# Altium project LAMP Chip PCB.PrjPCB
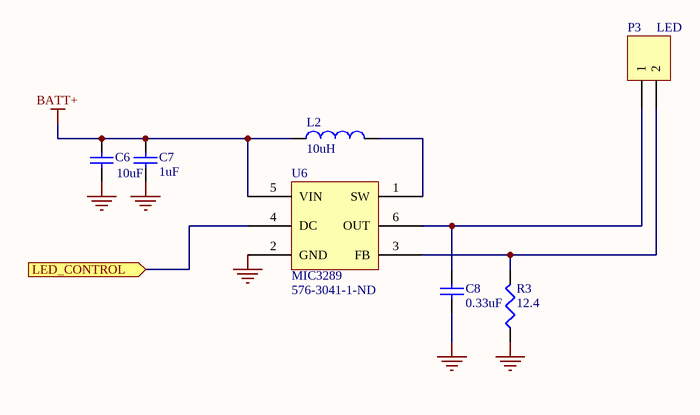
[diagram p0: LED Driver.SchDoc]
3 sheets, 133 parts. Net scope: flat (ports and power ports of the same name join across sheets).
Board file: Chip Reader PCB.PcbDoc
Sheets:
  LED Driver.SchDoc
  Heater Driver.SchDoc
  Photodiodes.SchDoc

## Sheet LED Driver.SchDoc: MicroBAR - LED Driver Circuit
size A; DrawnBy: Frankie Myers; Engineer: Frankie Myers; Organization: UC Berkeley

### Parts
C6  value 10uF  [CAPC3216L]  (hidden comment: Cap)
C7  value 1uF  [CAPC3216L]  (hidden comment: Cap Semi)
C8  value 0.33uF  [CAPC3216L]  (hidden comment: Cap Semi)
L2  value 10uH  [MURATA SMT INDUCTOR]  (hidden comment: Inductor)
P3  LED  [2MM JST PH - 2 PIN]
R3  value 12.4  [RESC3216L]  (hidden comment: Res3)
U6  MIC3289  Supplier Part Number 1: 576-3041-1-ND  [SOT-23_A]

### Ports
LED_CONTROL

### Nets
BATT+: C6.2 C7.2 L2.1 U6.5(VIN)
GND: C6.1 C7.1 C8.1 R3.1 U6.2(GND)
NetC8_2: C8.2 P3.1 U6.6(OUT)
NetL2_2: L2.2 U6.1(SW)
NetP1_13: U6.4(DC) ; port LED_CONTROL
NetP3_2: P3.2 R3.2 U6.3(FB)

### Library data of the parts
C6 = Cap: Capacitor; Published: 8-Jun-2000; LatestRevisionDate: 17-Jul-2002; LatestRevisionNote: Re-released for DXP Platform.; PackageReference: RAD-0.3; Publisher: Altium Limited
C7 C8 = Cap Semi: Capacitor (Semiconductor SIM Model); Published: 8-Jun-2000; LatestRevisionDate: 29-May-2009; LatestRevisionNote: IPC-7351 Footprint Added.; PackageReference: C1206; Publisher: Altium Limited; PackageDescription: Chip Capacitor
L2 = Inductor: Code_IEC: 1005; Published: 8-Jun-2000; LatestRevisionDate: 29-May-2009; LatestRevisionNote: IPC-7351 Footprint Added.; PackageReference: 0402-A; Publisher: Altium Limited; PackageDescription: Chip Inductor; Code_JEITA: 0402
P3 = Header 2: Header, 2-Pin; LatestRevisionDate: 17-Jul-2002; LatestRevisionNote: Re-released for DXP Platform.; Publisher: Altium Limited
R3 = Res3: Resistor; Published: 8-Jun-2000; LatestRevisionDate: 29-May-2009; LatestRevisionNote: IPC-7351 Footprint Added.; PackageReference: J1-0603; Publisher: Altium Limited; PackageDescription: Chip Resistor
U6 = MIC3289: Supplier 1: Digi-Key

## Sheet Heater Driver.SchDoc: MicroBAR - Step-Up DC-DC Converter for ITO Heater
size A; DrawnBy: Frankie Myers; Engineer: Frankie Myers; Organization: UC Berkeley
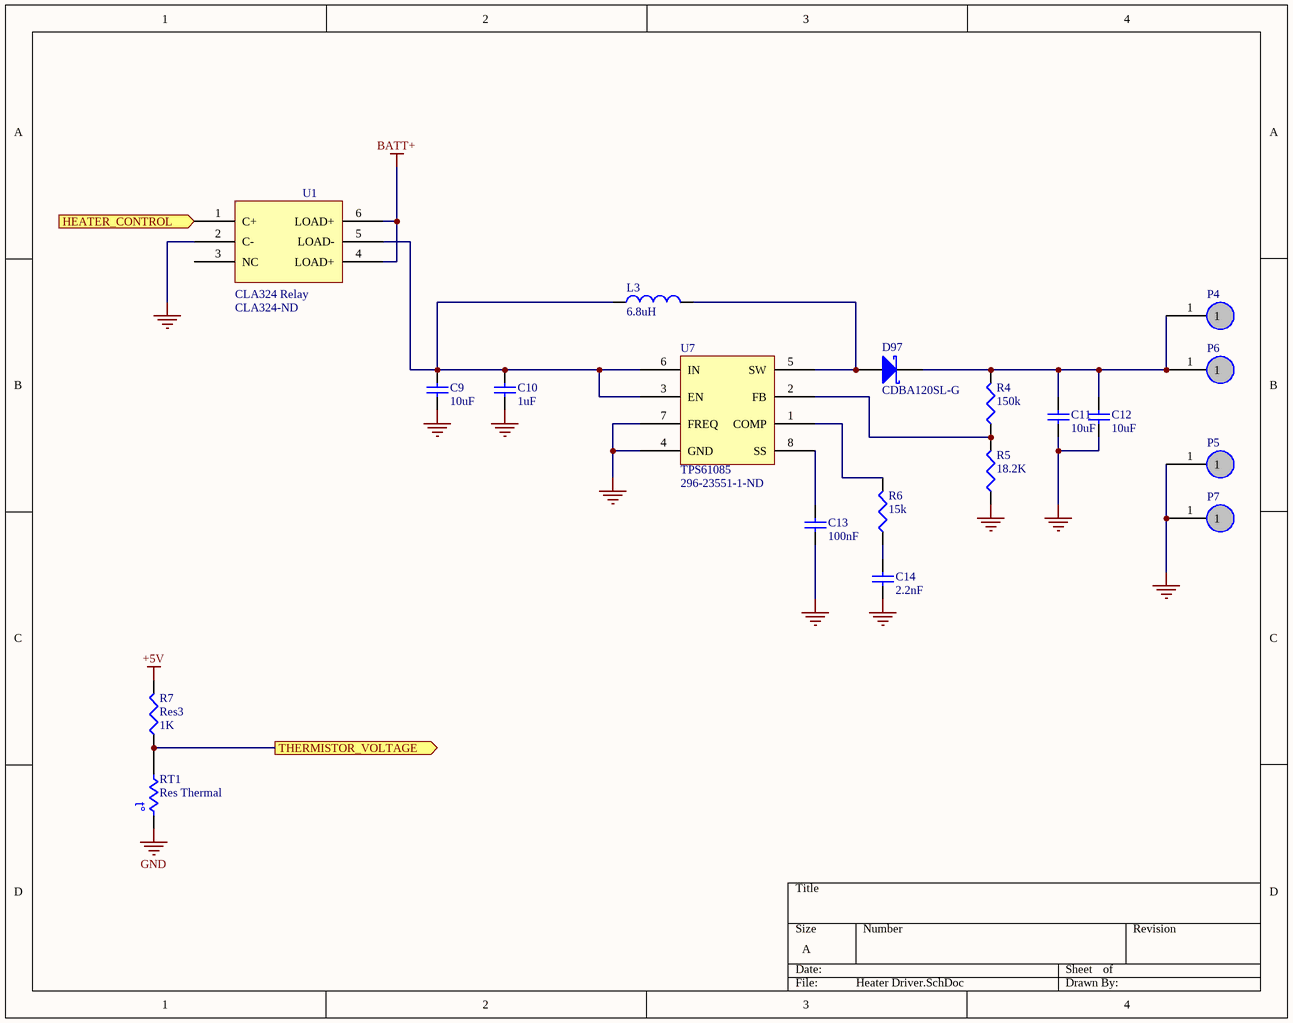
[diagram p1: Heater Driver.SchDoc]

### Parts
C9  value 10uF  [CAPC3216L]  (hidden comment: Cap Semi)
C10  value 1uF  [CAPC3216L]  (hidden comment: Cap Semi)
C11  value 10uF  [CAPC3216L]  (hidden comment: Cap Semi)
C12  value 10uF  [CAPC3216L]  (hidden comment: Cap Semi)
C13  value 100nF  [CAPC3216L]  (hidden comment: Cap Semi)
C14  value 2.2nF  [CAPC3216L]  (hidden comment: Cap Semi)
D97  CDBA120SL-G  [DSO-C2/G1.6]
L3  value 6.8uH  [MURATA SMT INDUCTOR]  (hidden comment: Inductor)
P4  LARGE_PIN  [2.5mm PIN]  (value not drawn)
P5  LARGE_PIN  [2.5mm PIN]  (value not drawn)
P6  LARGE_PIN  [2.5mm PIN]  (value not drawn)
P7  LARGE_PIN  [2.5mm PIN]  (value not drawn)
R4  value 150k  [RESC3216L]  (hidden comment: Res3)
R5  value 18.2K  [RESC3216L]  (hidden comment: Res3)
R6  value 15k  [RESC3216L]  (hidden comment: Res3)
R7  Res3  value 1K  [RESC3216M]
RT1  Res Thermal  [2MM JST PH - 2 PIN]
U1  CLA324 Relay  Supplier Part Number 1: CLA324-ND  [6-SMD]
U7  TPS61085  Supplier Part Number 1: 296-23551-1-ND  [DB008]

### Ports
HEATER_CONTROL, THERMISTOR_VOLTAGE

### Nets
+5V: R7.2
BATT+: U1.4(LOAD+) U1.6(LOAD+)
GND: C9.1 C10.1 C11.1 C12.1 C13.1 C14.1 P5.1 P7.1 R5.1 U1.2(C-) U7.4(GND) U7.7(FREQ)
NetC9_2: C9.2 C10.2 L3.1 U1.5(LOAD-) U7.3(EN) U7.6(IN)
NetC11_2: C11.2 C12.2 D97.2(K) P4.1 P6.1 R4.2
NetC13_2: C13.2 U7.8(SS)
NetC14_2: C14.2 R6.1
NetD97_1: D97.1(A) L3.2 U7.5(SW)
NetP1_11: R7.1 RT1.2 ; port THERMISTOR_VOLTAGE
NetP1_12: U1.1(C+) ; port HEATER_CONTROL
NetR4_1: R4.1 R5.2 U7.2(FB)
NetR6_2: R6.2 U7.1(COMP)

Not connected (* = marked no-connect by the designer): RT1 1; U1 3(NC)

### Notes on the sheet
- Labels drawn without touching a wire or pin: GND
- (in symbol Res Thermal) t°

### Library data of the parts
C9-C14 = Cap Semi: Capacitor (Semiconductor SIM Model); Published: 8-Jun-2000; LatestRevisionDate: 29-May-2009; LatestRevisionNote: IPC-7351 Footprint Added.; PackageReference: C1206; Publisher: Altium Limited; PackageDescription: Chip Capacitor
D97 = Diode BAS70: Note: Pin 2 is not connected and not drawn.; Published: 21-Mar-2003; LatestRevisionDate: 29-May-2009; LatestRevisionNote: IPC-7351 Footprint Added.; DatasheetVersion: Oct-1999; PackageVersion: Sep-2001; PackageReference: SOT-23; Publisher: Altium Limited; PackageDescription: 3-Pin SOT-23 Package 0.95 mm Pitch, 2.5 mm Lead Span; ComponentLink1Description: Manufacturer Link; ComponentLink1URL: http://www.infineon.com/; ComponentLink2Description: Datasheet; ComponentLink2URL: http://www.infineon.com/upload/Document/cmc_upload/documents/009/382/bas40_bas140series_1.pdf
L3 = Inductor: Code_IEC: 1005; Published: 8-Jun-2000; LatestRevisionDate: 29-May-2009; LatestRevisionNote: IPC-7351 Footprint Added.; PackageReference: 0402-A; Publisher: Altium Limited; PackageDescription: Chip Inductor; Code_JEITA: 0402
R4-R7 = Res3: Resistor; Published: 8-Jun-2000; PackageReference: J1-0603; Publisher: Altium Limited
  R4-R6: LatestRevisionDate: 29-May-2009; LatestRevisionNote: IPC-7351 Footprint Added.; PackageDescription: Chip Resistor
  R7: LatestRevisionDate: 04-Mar-2005; LatestRevisionNote: PCB Footprint replaced.
RT1 = Res Thermal: Thermistor; Published: 24-Mar-1999; LatestRevisionDate: 04-Mar-2005; LatestRevisionNote: PCB Footprint replaced.; PackageReference: 6-0805; Publisher: Altium Limited
U1 = CLA324 Relay: Supplier 1: Digi-Key
U7 = TPS61085: Supplier 1: Digi-Key

## Sheet Photodiodes.SchDoc: MicroBAR - Phototransistor Array
size C portrait; CompanyName: UC Berkeley; DrawnBy: Frankie Myers; Engineer: Frankie Myers; PageSetup: Record=PageOptions|CenterHorizontal=True|CenterVertical=True|PrintScale=0.52|XCorrection=1.00|YCorrection=1.00|PrintKind=1|BorderSize=5000000|LeftOffset=0|BottomOffset=0|Orientation=1|PaperLength=1000|PaperWidth=1000|Scale=100|PaperSource=7|PrintQuality=-4|MediaType=1|DitherType=10|PaperKind=Letter|PrintScaleMode=1
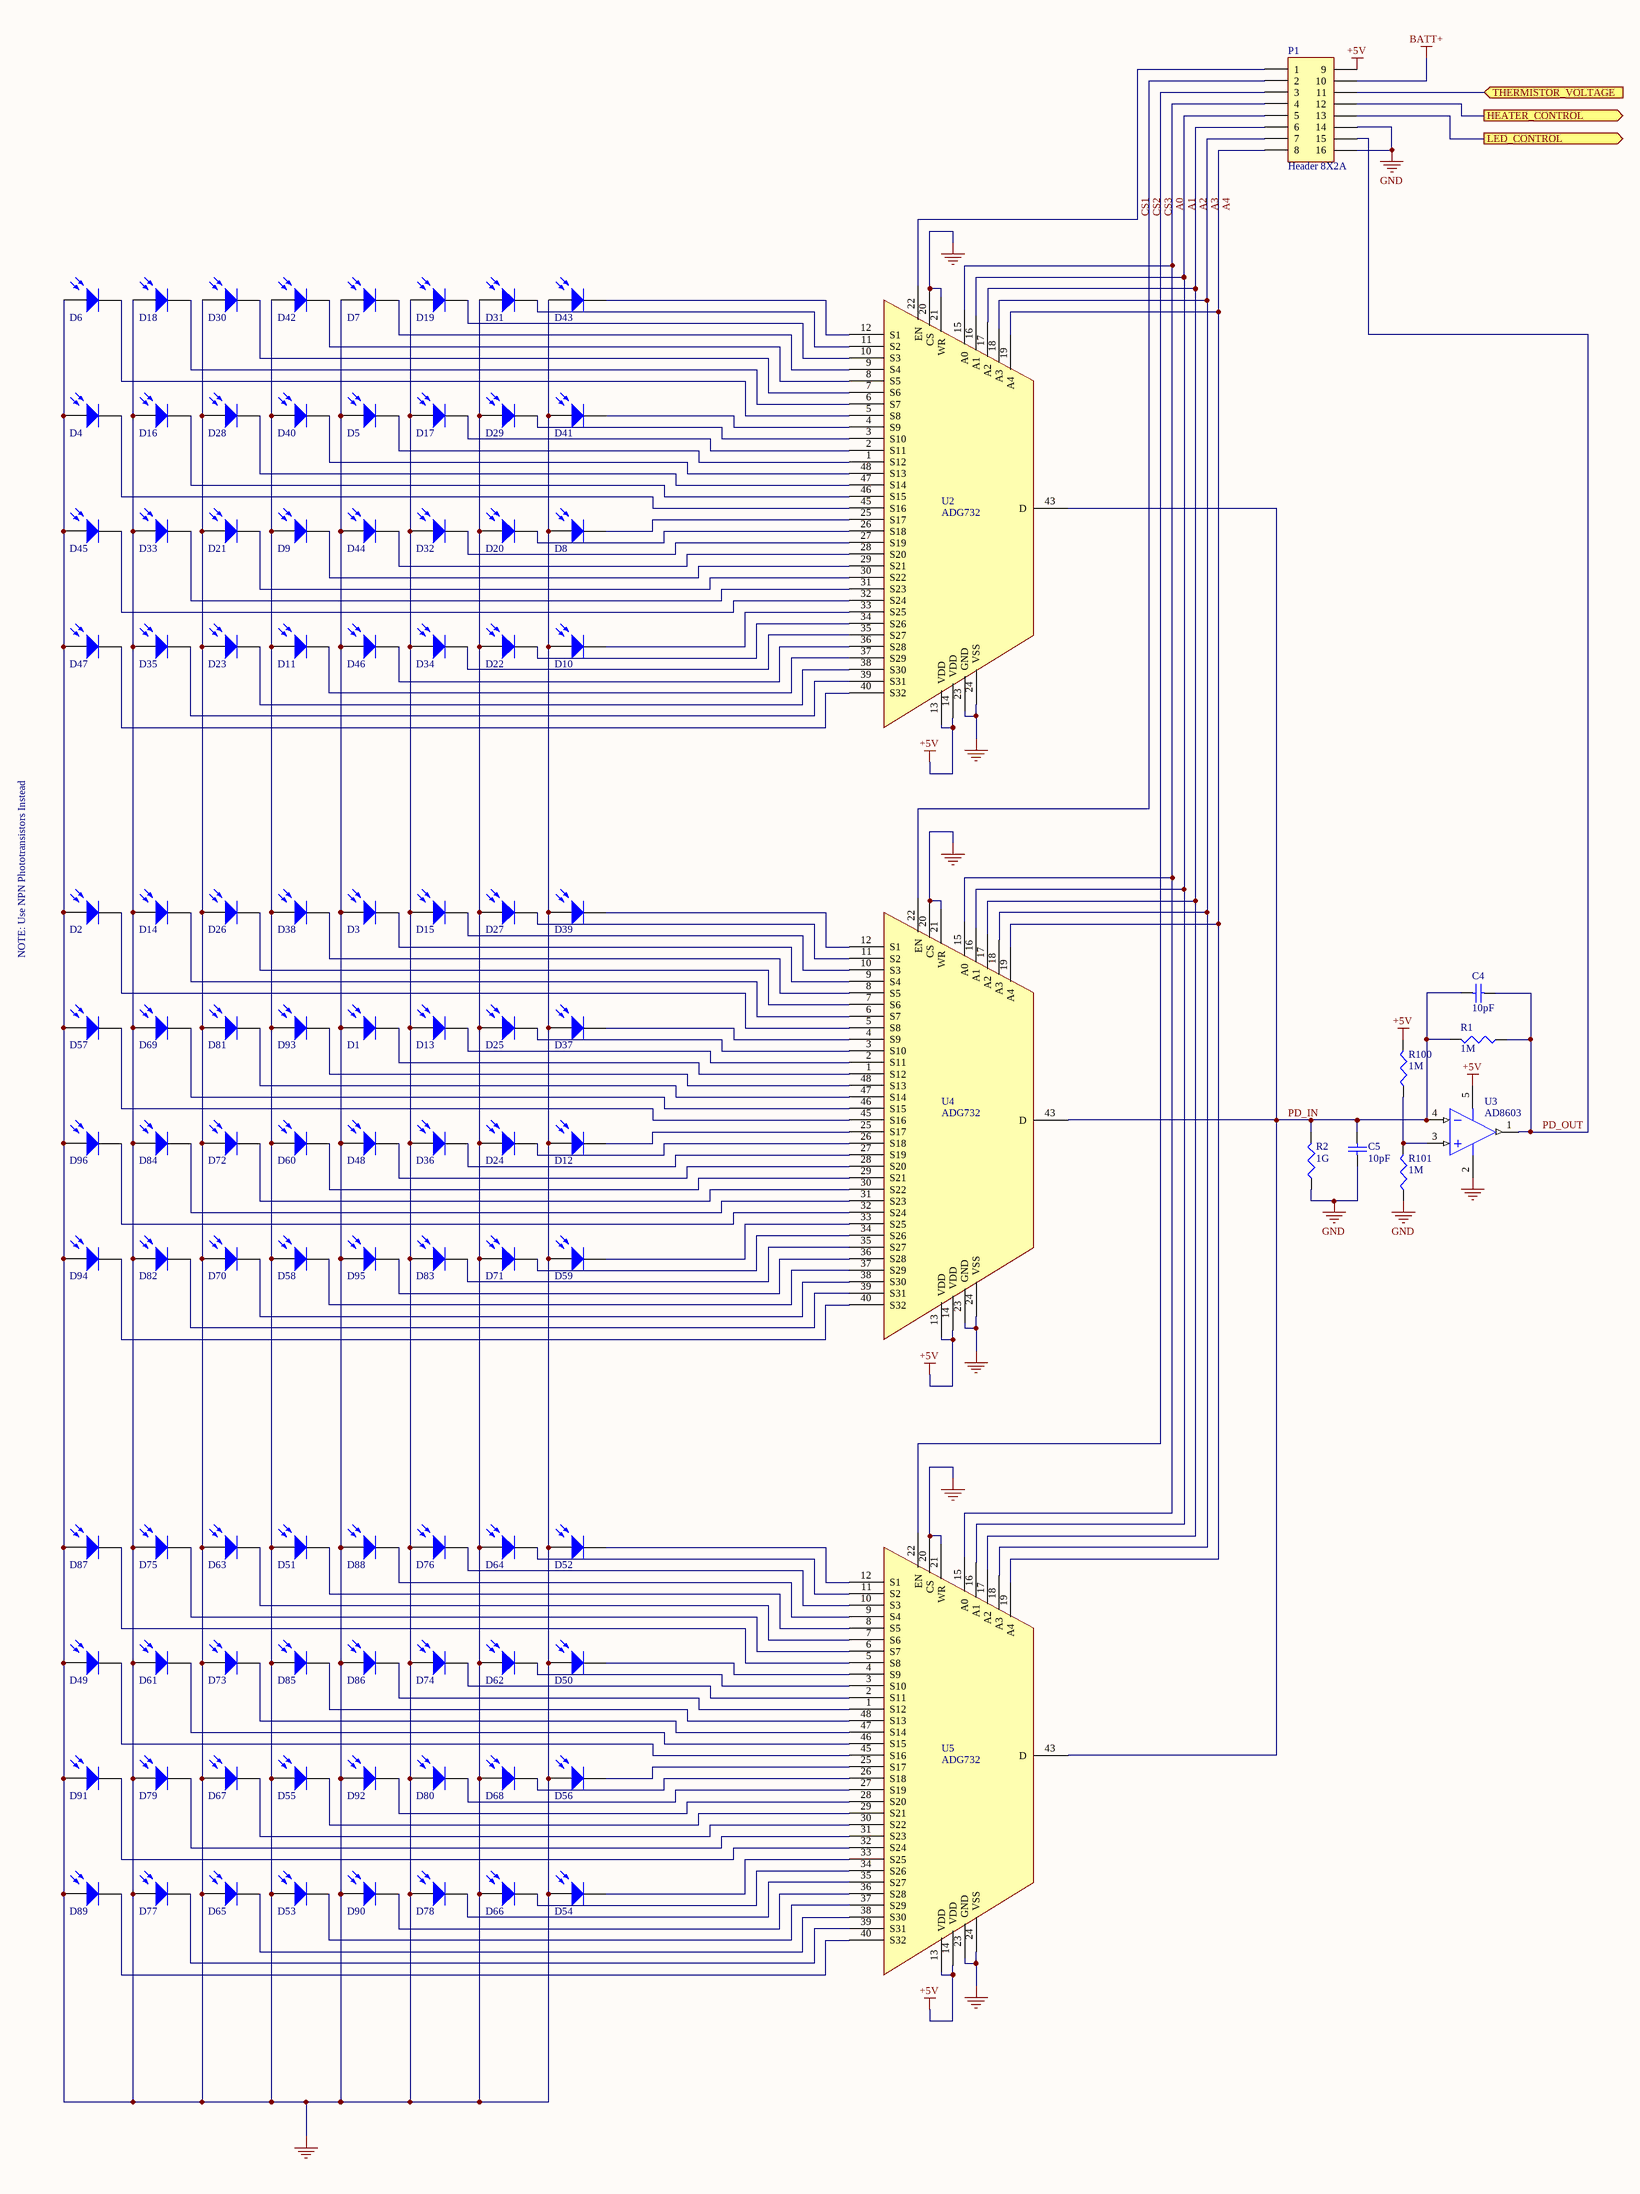
[diagram p2: Photodiodes.SchDoc]

### Parts
C4  value 10pF  [CAPC3216L]  (hidden comment: Cap Semi)
C5  value 10pF  [CAPC3216L]  (hidden comment: Cap Semi)
D1  Photo Sen  [CAPC2012L]  (value not drawn)
D2  Photo Sen  [CAPC2012L]  (value not drawn)
D3  Photo Sen  [CAPC2012L]  (value not drawn)
D4  Photo Sen  [CAPC2012L]  (value not drawn)
D5  Photo Sen  [CAPC2012L]  (value not drawn)
D6  Photo Sen  [CAPC2012L]  (value not drawn)
D7  Photo Sen  [CAPC2012L]  (value not drawn)
D8  Photo Sen  [CAPC2012L]  (value not drawn)
D9  Photo Sen  [CAPC2012L]  (value not drawn)
D10  Photo Sen  [CAPC2012L]  (value not drawn)
D11  Photo Sen  [CAPC2012L]  (value not drawn)
D12  Photo Sen  [CAPC2012L]  (value not drawn)
D13  Photo Sen  [CAPC2012L]  (value not drawn)
D14  Photo Sen  [CAPC2012L]  (value not drawn)
D15  Photo Sen  [CAPC2012L]  (value not drawn)
D16  Photo Sen  [CAPC2012L]  (value not drawn)
D17  Photo Sen  [CAPC2012L]  (value not drawn)
D18  Photo Sen  [CAPC2012L]  (value not drawn)
D19  Photo Sen  [CAPC2012L]  (value not drawn)
D20  Photo Sen  [CAPC2012L]  (value not drawn)
D21  Photo Sen  [CAPC2012L]  (value not drawn)
D22  Photo Sen  [CAPC2012L]  (value not drawn)
D23  Photo Sen  [CAPC2012L]  (value not drawn)
D24  Photo Sen  [CAPC2012L]  (value not drawn)
D25  Photo Sen  [CAPC2012L]  (value not drawn)
D26  Photo Sen  [CAPC2012L]  (value not drawn)
D27  Photo Sen  [CAPC2012L]  (value not drawn)
D28  Photo Sen  [CAPC2012L]  (value not drawn)
D29  Photo Sen  [CAPC2012L]  (value not drawn)
D30  Photo Sen  [CAPC2012L]  (value not drawn)
D31  Photo Sen  [CAPC2012L]  (value not drawn)
D32  Photo Sen  [CAPC2012L]  (value not drawn)
D33  Photo Sen  [CAPC2012L]  (value not drawn)
D34  Photo Sen  [CAPC2012L]  (value not drawn)
D35  Photo Sen  [CAPC2012L]  (value not drawn)
D36  Photo Sen  [CAPC2012L]  (value not drawn)
D37  Photo Sen  [CAPC2012L]  (value not drawn)
D38  Photo Sen  [CAPC2012L]  (value not drawn)
D39  Photo Sen  [CAPC2012L]  (value not drawn)
D40  Photo Sen  [CAPC2012L]  (value not drawn)
D41  Photo Sen  [CAPC2012L]  (value not drawn)
D42  Photo Sen  [CAPC2012L]  (value not drawn)
D43  Photo Sen  [CAPC2012L]  (value not drawn)
D44  Photo Sen  [CAPC2012L]  (value not drawn)
D45  Photo Sen  [CAPC2012L]  (value not drawn)
D46  Photo Sen  [CAPC2012L]  (value not drawn)
D47  Photo Sen  [CAPC2012L]  (value not drawn)
D48  Photo Sen  [CAPC2012L]  (value not drawn)
D49  Photo Sen  [CAPC2012L]  (value not drawn)
D50  Photo Sen  [CAPC2012L]  (value not drawn)
D51  Photo Sen  [CAPC2012L]  (value not drawn)
D52  Photo Sen  [CAPC2012L]  (value not drawn)
D53  Photo Sen  [CAPC2012L]  (value not drawn)
D54  Photo Sen  [CAPC2012L]  (value not drawn)
D55  Photo Sen  [CAPC2012L]  (value not drawn)
D56  Photo Sen  [CAPC2012L]  (value not drawn)
D57  Photo Sen  [CAPC2012L]  (value not drawn)
D58  Photo Sen  [CAPC2012L]  (value not drawn)
D59  Photo Sen  [CAPC2012L]  (value not drawn)
D60  Photo Sen  [CAPC2012L]  (value not drawn)
D61  Photo Sen  [CAPC2012L]  (value not drawn)
D62  Photo Sen  [CAPC2012L]  (value not drawn)
D63  Photo Sen  [CAPC2012L]  (value not drawn)
D64  Photo Sen  [CAPC2012L]  (value not drawn)
D65  Photo Sen  [CAPC2012L]  (value not drawn)
D66  Photo Sen  [CAPC2012L]  (value not drawn)
D67  Photo Sen  [CAPC2012L]  (value not drawn)
D68  Photo Sen  [CAPC2012L]  (value not drawn)
D69  Photo Sen  [CAPC2012L]  (value not drawn)
D70  Photo Sen  [CAPC2012L]  (value not drawn)
D71  Photo Sen  [CAPC2012L]  (value not drawn)
D72  Photo Sen  [CAPC2012L]  (value not drawn)
D73  Photo Sen  [CAPC2012L]  (value not drawn)
D74  Photo Sen  [CAPC2012L]  (value not drawn)
D75  Photo Sen  [CAPC2012L]  (value not drawn)
D76  Photo Sen  [CAPC2012L]  (value not drawn)
D77  Photo Sen  [CAPC2012L]  (value not drawn)
D78  Photo Sen  [CAPC2012L]  (value not drawn)
D79  Photo Sen  [CAPC2012L]  (value not drawn)
D80  Photo Sen  [CAPC2012L]  (value not drawn)
D81  Photo Sen  [CAPC2012L]  (value not drawn)
D82  Photo Sen  [CAPC2012L]  (value not drawn)
D83  Photo Sen  [CAPC2012L]  (value not drawn)
D84  Photo Sen  [CAPC2012L]  (value not drawn)
D85  Photo Sen  [CAPC2012L]  (value not drawn)
D86  Photo Sen  [CAPC2012L]  (value not drawn)
D87  Photo Sen  [CAPC2012L]  (value not drawn)
D88  Photo Sen  [CAPC2012L]  (value not drawn)
D89  Photo Sen  [CAPC2012L]  (value not drawn)
D90  Photo Sen  [CAPC2012L]  (value not drawn)
D91  Photo Sen  [CAPC2012L]  (value not drawn)
D92  Photo Sen  [CAPC2012L]  (value not drawn)
D93  Photo Sen  [CAPC2012L]  (value not drawn)
D94  Photo Sen  [CAPC2012L]  (value not drawn)
D95  Photo Sen  [CAPC2012L]  (value not drawn)
D96  Photo Sen  [CAPC2012L]  (value not drawn)
P1  Header 8X2A  [HDR2X8_CEN]
R1  value 1M  [RESC3216L]  (hidden comment: Res3)
R2  value 1G  [RESC3216L]  (hidden comment: Res3)
R100  value 1M  [RESC3216L]  (hidden comment: Res3)
R101  value 1M  [RESC3216L]  (hidden comment: Res3)
U2  ADG732  Supplier Part Number 1: ADG732BSUZ-ND  [ST-48_M]
U3  AD8603  [RJ-5]
U4  ADG732  Supplier Part Number 1: ADG732BSUZ-ND  [ST-48_M]
U5  ADG732  Supplier Part Number 1: ADG732BSUZ-ND  [ST-48_M]

### Ports
HEATER_CONTROL, LED_CONTROL, THERMISTOR_VOLTAGE

### Nets
+5V: P1.9 R100.2 U2.13(VDD) U2.14(VDD) U3.5(V+) U4.13(VDD) U4.14(VDD) U5.13(VDD) U5.14(VDD)
BATT+: P1.10
GND: C5.1 D1.1(A) D2.1(A) D3.1(A) D4.1(A) D5.1(A) D6.1(A) D7.1(A) D8.1(A) D9.1(A) D10.1(A) D11.1(A) D12.1(A) D13.1(A) D14.1(A) D15.1(A) D16.1(A) D17.1(A) D18.1(A) D19.1(A) D20.1(A) D21.1(A) D22.1(A) D23.1(A) D24.1(A) D25.1(A) D26.1(A) D27.1(A) D28.1(A) D29.1(A) D30.1(A) D31.1(A) D32.1(A) D33.1(A) D34.1(A) D35.1(A) D36.1(A) D37.1(A) D38.1(A) D39.1(A) D40.1(A) D41.1(A) D42.1(A) D43.1(A) D44.1(A) D45.1(A) D46.1(A) D47.1(A) D48.1(A) D49.1(A) D50.1(A) D51.1(A) D52.1(A) D53.1(A) D54.1(A) D55.1(A) D56.1(A) D57.1(A) D58.1(A) D59.1(A) D60.1(A) D61.1(A) D62.1(A) D63.1(A) D64.1(A) D65.1(A) D66.1(A) D67.1(A) D68.1(A) D69.1(A) D70.1(A) D71.1(A) D72.1(A) D73.1(A) D74.1(A) D75.1(A) D76.1(A) D77.1(A) D78.1(A) D79.1(A) D80.1(A) D81.1(A) D82.1(A) D83.1(A) D84.1(A) D85.1(A) D86.1(A) D87.1(A) D88.1(A) D89.1(A) D90.1(A) D91.1(A) D92.1(A) D93.1(A) D94.1(A) D95.1(A) D96.1(A) P1.14 P1.16 R2.1 R101.1 U2.20(CS) U2.21(WR) U2.23(GND) U2.24(VSS) U3.2(V-) U4.20(CS) U4.21(WR) U4.23(GND) U4.24(VSS) U5.20(CS) U5.21(WR) U5.23(GND) U5.24(VSS)
A0: P1.4 U2.15(A0) U4.15(A0) U5.15(A0)
A1: P1.5 U2.16(A1) U4.16(A1) U5.16(A1)
A2: P1.6 U2.17(A2) U4.17(A2) U5.17(A2)
A3: P1.7 U2.18(A3) U4.18(A3) U5.18(A3)
A4: P1.8 U2.19(A4) U4.19(A4) U5.19(A4)
CS1: P1.1 U2.22(EN)
CS2: P1.2 U4.22(EN)
CS3: P1.3 U5.22(EN)
PD_IN: C4.1 C5.2 R1.2 R2.2 U2.43(D) U3.4(IN-) U4.43(D) U5.43(D)
PD_OUT: C4.2 P1.15 R1.1 U3.1(OUT)
NetD1_2: D1.2(K) U4.1(S12)
NetD2_2: D2.2(K) U4.5(S8)
NetD3_2: D3.2(K) U4.9(S4)
NetD4_2: D4.2(K) U2.45(S16)
NetD5_2: D5.2(K) U2.1(S12)
NetD6_2: D6.2(K) U2.5(S8)
NetD7_2: D7.2(K) U2.9(S4)
NetD8_2: D8.2(K) U2.25(S17)
NetD9_2: D9.2(K) U2.29(S21)
NetD10_2: D10.2(K) U2.33(S25)
NetD11_2: D11.2(K) U2.37(S29)
NetD12_2: D12.2(K) U4.25(S17)
NetD13_2: D13.2(K) U4.2(S11)
NetD14_2: D14.2(K) U4.6(S7)
NetD15_2: D15.2(K) U4.10(S3)
NetD16_2: D16.2(K) U2.46(S15)
NetD17_2: D17.2(K) U2.2(S11)
NetD18_2: D18.2(K) U2.6(S7)
NetD19_2: D19.2(K) U2.10(S3)
NetD20_2: D20.2(K) U2.26(S18)
NetD21_2: D21.2(K) U2.30(S22)
NetD22_2: D22.2(K) U2.34(S26)
NetD23_2: D23.2(K) U2.38(S30)
NetD24_2: D24.2(K) U4.26(S18)
NetD25_2: D25.2(K) U4.3(S10)
NetD26_2: D26.2(K) U4.7(S6)
NetD27_2: D27.2(K) U4.11(S2)
NetD28_2: D28.2(K) U2.47(S14)
NetD29_2: D29.2(K) U2.3(S10)
NetD30_2: D30.2(K) U2.7(S6)
NetD31_2: D31.2(K) U2.11(S2)
NetD32_2: D32.2(K) U2.27(S19)
NetD33_2: D33.2(K) U2.31(S23)
NetD34_2: D34.2(K) U2.35(S27)
NetD35_2: D35.2(K) U2.39(S31)
NetD36_2: D36.2(K) U4.27(S19)
NetD37_2: D37.2(K) U4.4(S9)
NetD38_2: D38.2(K) U4.8(S5)
NetD39_2: D39.2(K) U4.12(S1)
NetD40_2: D40.2(K) U2.48(S13)
NetD41_2: D41.2(K) U2.4(S9)
NetD42_2: D42.2(K) U2.8(S5)
NetD43_2: D43.2(K) U2.12(S1)
NetD44_2: D44.2(K) U2.28(S20)
NetD45_2: D45.2(K) U2.32(S24)
NetD46_2: D46.2(K) U2.36(S28)
NetD47_2: D47.2(K) U2.40(S32)
NetD48_2: D48.2(K) U4.28(S20)
NetD49_2: D49.2(K) U5.45(S16)
NetD50_2: D50.2(K) U5.4(S9)
NetD51_2: D51.2(K) U5.8(S5)
NetD52_2: D52.2(K) U5.12(S1)
NetD53_2: D53.2(K) U5.37(S29)
NetD54_2: D54.2(K) U5.33(S25)
NetD55_2: D55.2(K) U5.29(S21)
NetD56_2: D56.2(K) U5.25(S17)
NetD57_2: D57.2(K) U4.45(S16)
NetD58_2: D58.2(K) U4.37(S29)
NetD59_2: D59.2(K) U4.33(S25)
NetD60_2: D60.2(K) U4.29(S21)
NetD61_2: D61.2(K) U5.46(S15)
NetD62_2: D62.2(K) U5.3(S10)
NetD63_2: D63.2(K) U5.7(S6)
NetD64_2: D64.2(K) U5.11(S2)
NetD65_2: D65.2(K) U5.38(S30)
NetD66_2: D66.2(K) U5.34(S26)
NetD67_2: D67.2(K) U5.30(S22)
NetD68_2: D68.2(K) U5.26(S18)
NetD69_2: D69.2(K) U4.46(S15)
NetD70_2: D70.2(K) U4.38(S30)
NetD71_2: D71.2(K) U4.34(S26)
NetD72_2: D72.2(K) U4.30(S22)
NetD73_2: D73.2(K) U5.47(S14)
NetD74_2: D74.2(K) U5.2(S11)
NetD75_2: D75.2(K) U5.6(S7)
NetD76_2: D76.2(K) U5.10(S3)
NetD77_2: D77.2(K) U5.39(S31)
NetD78_2: D78.2(K) U5.35(S27)
NetD79_2: D79.2(K) U5.31(S23)
NetD80_2: D80.2(K) U5.27(S19)
NetD81_2: D81.2(K) U4.47(S14)
NetD82_2: D82.2(K) U4.39(S31)
NetD83_2: D83.2(K) U4.35(S27)
NetD84_2: D84.2(K) U4.31(S23)
NetD85_2: D85.2(K) U5.48(S13)
NetD86_2: D86.2(K) U5.1(S12)
NetD87_2: D87.2(K) U5.5(S8)
NetD88_2: D88.2(K) U5.9(S4)
NetD89_2: D89.2(K) U5.40(S32)
NetD90_2: D90.2(K) U5.36(S28)
NetD91_2: D91.2(K) U5.32(S24)
NetD92_2: D92.2(K) U5.28(S20)
NetD93_2: D93.2(K) U4.48(S13)
NetD94_2: D94.2(K) U4.40(S32)
NetD95_2: D95.2(K) U4.36(S28)
NetD96_2: D96.2(K) U4.32(S24)
NetP1_11: P1.11 ; port THERMISTOR_VOLTAGE
NetP1_12: P1.12 ; port HEATER_CONTROL
NetP1_13: P1.13 ; port LED_CONTROL
NetR100_1: R100.1 R101.2 U3.3(IN+)

### Notes on the sheet
- NOTE: Use NPN Phototransistors Instead

### Library data of the parts
C4 C5 = Cap Semi: Capacitor (Semiconductor SIM Model); Published: 8-Jun-2000; LatestRevisionDate: 29-May-2009; LatestRevisionNote: IPC-7351 Footprint Added.; PackageReference: C1206; Publisher: Altium Limited; PackageDescription: Chip Capacitor
D1-D96 = Photo Sen: Photosensitive Diode; Published: 24-Mar-1999; LatestRevisionDate: 17-Jul-2002; LatestRevisionNote: Re-released for DXP Platform.; PackageReference: PIN2; Publisher: Altium Limited
P1 = Header 8X2A: Header, 8-Pin, Dual row; LatestRevisionDate: 17-Jul-2002; LatestRevisionNote: Re-released for DXP Platform.; Publisher: Altium Limited
R1 R2 R100 R101 = Res3: Resistor; Published: 8-Jun-2000; LatestRevisionDate: 29-May-2009; LatestRevisionNote: IPC-7351 Footprint Added.; PackageReference: J1-0603; Publisher: Altium Limited; PackageDescription: Chip Resistor
U3 = AD8051ART: Low Cost, Single, High-Speed Rail-to-Rail Amplifier; Published: 8-Jun-2000; LatestRevisionDate: 17-Jul-2002; LatestRevisionNote: Re-released for DXP Platform.; DatasheetVersion: Rev. F 2004; PackageVersion: 2005; PackageReference: RJ-5; Publisher: Altium Limited; PackageDescription: SOT-23/SC-74A; 5 Leads; Body 3.1 x 3 mm, inc. leads (LxW max); Code_JEDEC: MO-178AA; ComponentLink1Description: Manufacturer Link; ComponentLink1URL: http://www.analog.com/en/prod/0,,759_786_AD8051%2C00.html; ComponentLink2Description: Datasheet; ComponentLink2URL: http://www.analog.com/UploadedFiles/Data_Sheets/11673395AD8051_2_4_f.pdf
U2 U4 U5 = ADG732: Supplier 1: Digi-Key

## Nets that join several sheets
+5V: Heater Driver (R7.2), Photodiodes (9 pins)
BATT+: LED Driver (C6.2 C7.2 L2.1 U6.5), Heater Driver (U1.4 U1.6), Photodiodes (P1.10)
GND: LED Driver (5 pins), Heater Driver (12 pins), Photodiodes (114 pins)
NetP1_11: Heater Driver (R7.1 RT1.2), Photodiodes (P1.11)
NetP1_12: Heater Driver (U1.1), Photodiodes (P1.12)
NetP1_13: LED Driver (U6.4), Photodiodes (P1.13)